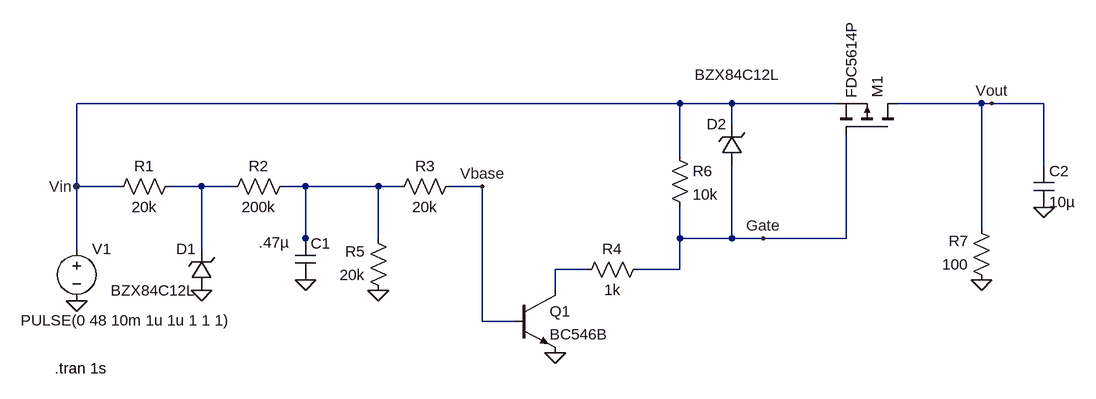
[diagram p0: schematic joeCkt.asc]
joeCkt.asc, the LTspice schematic file:
Version 4
SHEET 1 1448 680
WIRE 832 0 -96 0
WIRE 912 0 832 0
WIRE 1072 0 912 0
WIRE 1296 0 1168 0
WIRE 1312 0 1296 0
WIRE 1392 0 1312 0
WIRE 912 32 912 0
WIRE 832 80 832 0
WIRE 1392 96 1392 0
WIRE -96 128 -96 0
WIRE -32 128 -96 128
WIRE 96 128 48 128
WIRE 144 128 96 128
WIRE 256 128 224 128
WIRE 368 128 256 128
WIRE 400 128 368 128
WIRE 528 128 480 128
WIRE 1296 192 1296 0
WIRE 256 208 256 128
WIRE 368 208 368 128
WIRE 832 208 832 160
WIRE 912 208 912 96
WIRE 912 208 832 208
WIRE 960 208 912 208
WIRE 1088 208 1088 48
WIRE 1088 208 960 208
WIRE -96 224 -96 128
WIRE 96 224 96 128
WIRE 256 224 256 208
WIRE 688 256 640 256
WIRE 832 256 832 208
WIRE 832 256 768 256
WIRE 640 288 640 256
WIRE 528 336 528 128
WIRE 576 336 528 336
FLAG -96 304 0
FLAG 96 288 0
FLAG 256 272 0
FLAG 368 288 0
FLAG 640 384 0
FLAG 1296 272 0
FLAG 1392 160 0
FLAG 960 208 Gate
FLAG 1312 0 Vout
FLAG -96 128 Vin
FLAG 528 128 Vbase
SYMBOL res 64 112 R90
WINDOW 0 0 56 VBottom 2
WINDOW 3 32 56 VTop 2
SYMATTR InstName R1
SYMATTR Value 20k
SYMBOL res 240 112 R90
WINDOW 0 0 56 VBottom 2
WINDOW 3 32 56 VTop 2
SYMATTR InstName R2
SYMATTR Value 200k
SYMBOL res 496 112 R90
WINDOW 0 0 56 VBottom 2
WINDOW 3 32 56 VTop 2
SYMATTR InstName R3
SYMATTR Value 20k
SYMBOL res 784 240 R90
WINDOW 0 0 56 VBottom 2
WINDOW 3 32 56 VTop 2
SYMATTR InstName R4
SYMATTR Value 1k
SYMBOL res 384 304 R180
WINDOW 0 36 76 Left 2
WINDOW 3 36 40 Left 2
SYMATTR InstName R5
SYMATTR Value 20k
SYMBOL res 1312 288 R180
WINDOW 0 36 76 Left 2
WINDOW 3 36 40 Left 2
SYMATTR InstName R7
SYMATTR Value 100
SYMBOL npn 576 288 R0
SYMATTR InstName Q1
SYMATTR Value BC546B
SYMBOL zener 112 288 R180
WINDOW 0 24 64 Left 2
WINDOW 3 24 0 Left 2
SYMATTR InstName D1
SYMATTR Value BZX84C12L
SYMATTR Description Diode
SYMATTR Type diode
SYMBOL zener 928 96 R180
WINDOW 0 24 64 Left 2
WINDOW 3 -58 140 Left 2
SYMATTR InstName D2
SYMATTR Value BZX84C12L
SYMATTR Description Diode
SYMATTR Type diode
SYMBOL pmos 1168 48 M270
SYMATTR InstName M1
SYMATTR Value FDC5614P
SYMBOL voltage -96 208 R0
WINDOW 3 -86 126 Left 2
WINDOW 123 0 0 Left 0
WINDOW 39 0 0 Left 0
SYMATTR InstName V1
SYMATTR Value PULSE(0 48 10m 1u 1u 1 1 1)
SYMBOL cap 240 208 R0
WINDOW 3 -56 6 Left 2
SYMATTR InstName C1
SYMATTR Value .47µ
SYMBOL cap 1376 96 R0
SYMATTR InstName C2
SYMATTR Value 10µ
SYMBOL res 816 64 R0
SYMATTR InstName R6
SYMATTR Value 10k
TEXT -130 408 Left 2 !.tran 1s

The netlist it stands for:
* joeCkt.asc
R1 N001 Vin 20k
R2 N002 N001 200k
R3 Vbase N002 20k
R4 Gate N003 1k
R5 0 N002 20k
R7 0 Vout 100
Q1 N003 Vbase 0 0 BC546B
D1 0 N001 BZX84C12L
D2 Gate Vin BZX84C12L
M1 Vout Gate Vin Vin FDC5614P
V1 Vin 0 PULSE(0 48 10m 1u 1u 1 1 1)
C1 N002 0 .47µ
C2 Vout 0 10µ
R6 Vin Gate 10k
.model D D
.lib standard.dio
.model NPN NPN
.model PNP PNP
.lib standard.bjt
.model NMOS NMOS
.model PMOS PMOS
.lib standard.mos
.tran 1s
.backanno
.end